# EAGLE design mapleCUx_large_102 (EAGLE 7.3.0)
MAPLE-CUx Large Version
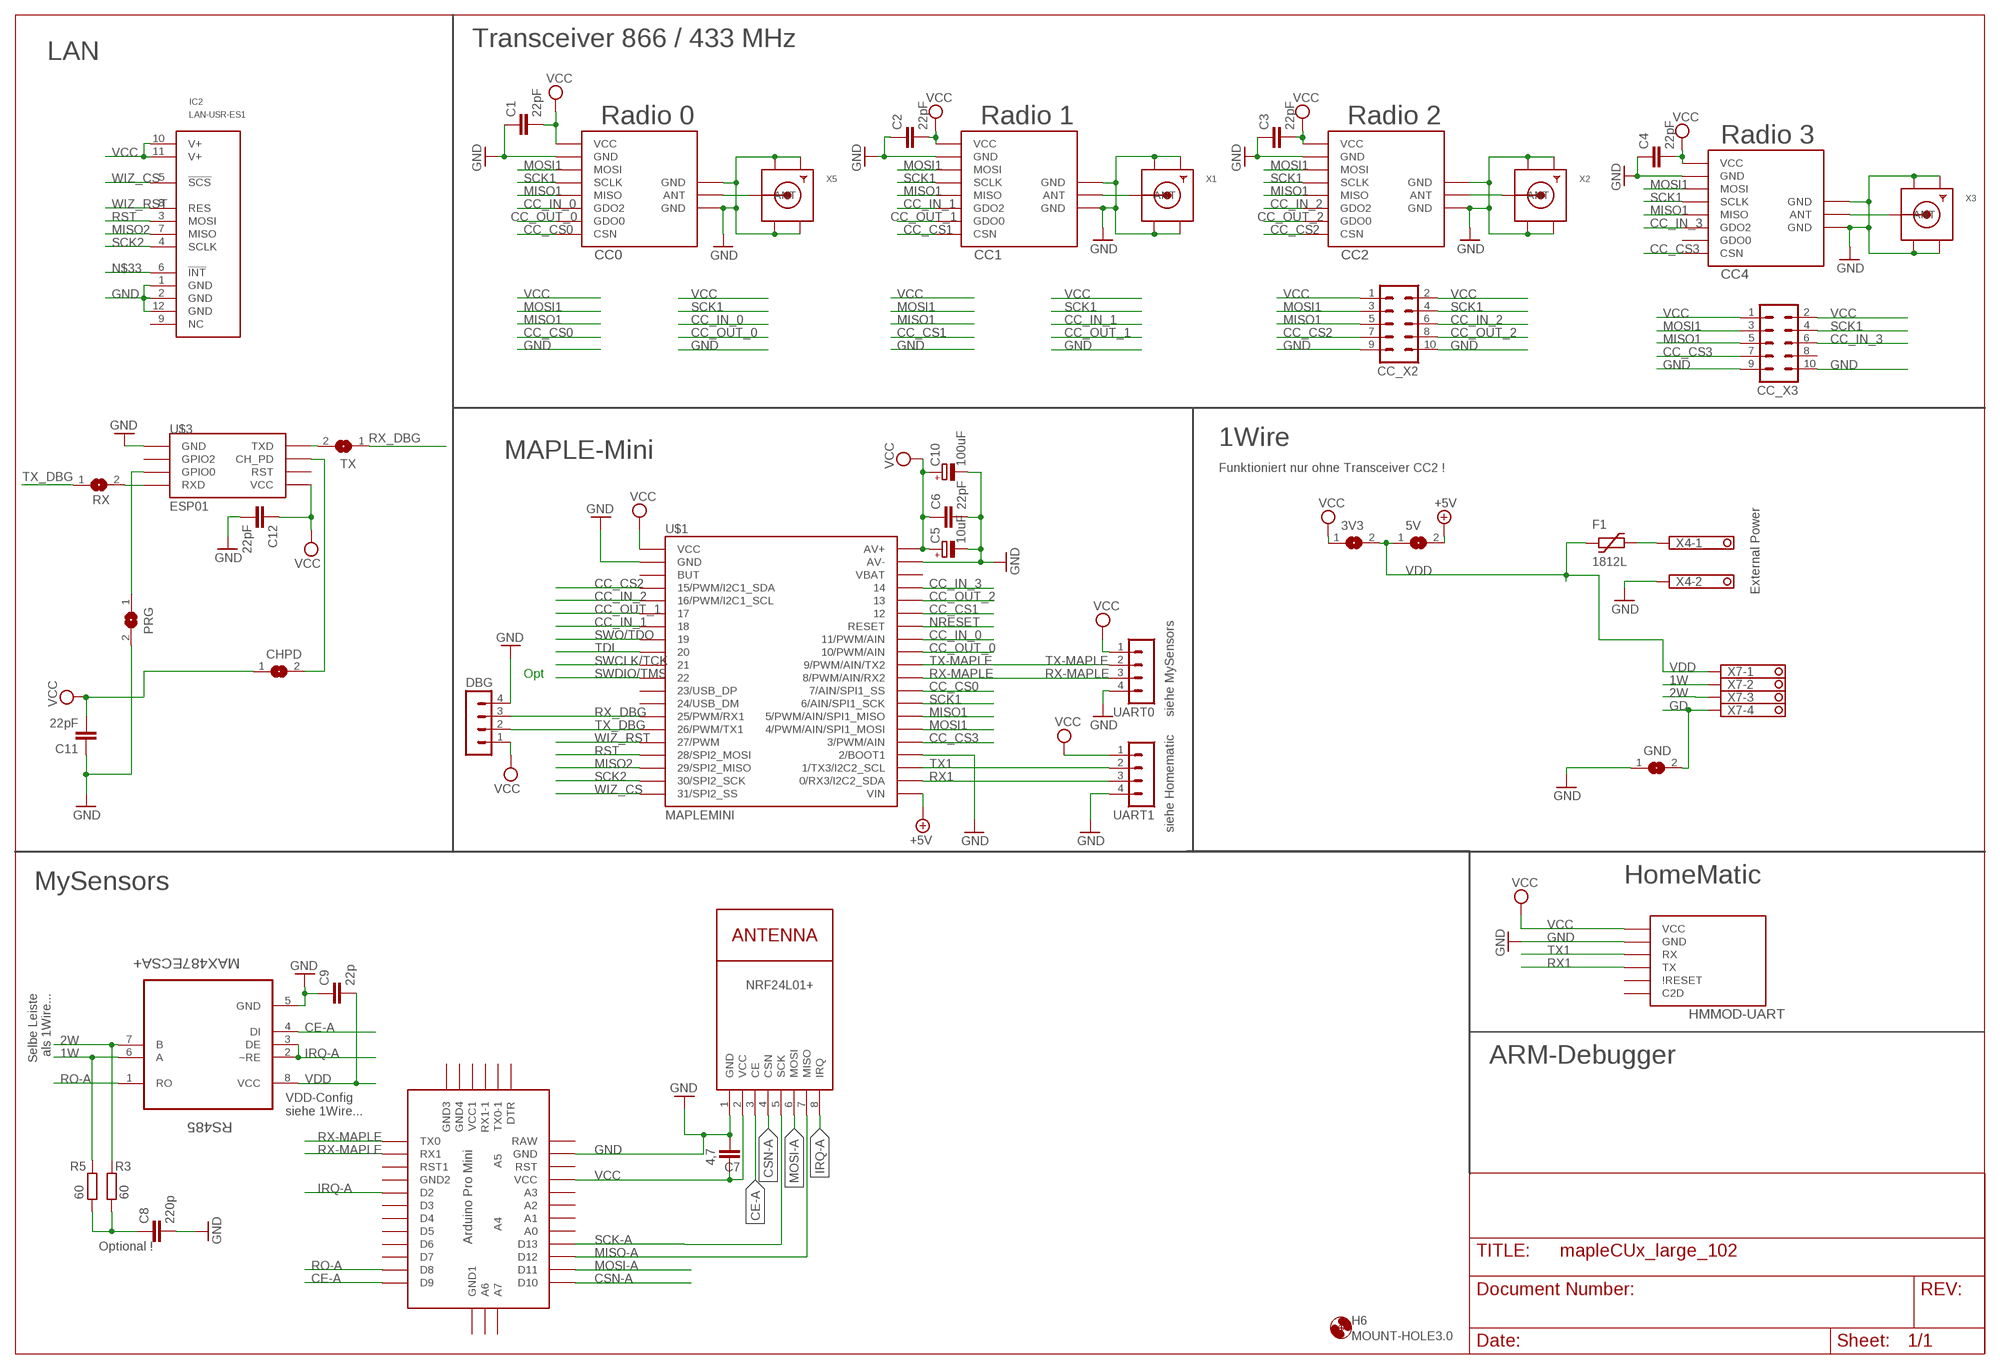
[diagram p0: schematic, sheet 1]

## Parts
3V3  SJ  [SJ]
5V  SJ  [SJ]
C1  22pF  C-EUC0805  [C0805]
C2  22pF  C-EUC0805  [C0805]
C3  22pF  C-EUC0805  [C0805]
C4  22pF  C-EUC0805  [C0805]
C5  10uF  CPOL-EUR/2012-12W  [R/2012-12W]
C6  22pF  C-EUC0805  [C0805]
C7  4,7  C-EUC1210  [C1210]
C8  220p  C-EUC0805  [C0805]
C9  22p  C-EUC0805  [C0805]
C10  100uF  CPOL-EUE5-8.5  [E5-8,5]
C11  22pF  C-EUC0805  [C0805]
C12  22pF  C-EUC0805  [C0805]
CC0  CC1101  CC1101_MODULE1SMD  [CC1101_MODULE1_SMD]
CC1  CC1101_MODULE1SMD  [CC1101_MODULE1_SMD]
CC2  CC1101_MODULE1SMD  [CC1101_MODULE1_SMD]
CC4  CC1101_MODULE1SMD  [CC1101_MODULE1_SMD]
CC_X2  MA05-2  [MA05-2]
CC_X3  MA05-2  [MA05-2]
CHPD  SJ  [SJ]
DBG  MA04-1  [MA04-1]
F1  1812L  [1812L]
GND  SJ  [SJ]
H6  MOUNT-HOLE3.0  [3,0]
HMMOD-UART  HM-MOD-UARTDIL  [HM-MOD-UART-DIL]
IC2  LAN-USR-ES1  [USR-ES1]
NRF24L01+  NRF24L01+  WIRELESS-NRF24L01  [WIRELESS-NRF24L01]
PRG  SJ  [SJ]
R3  60  R-EU_R0805  [R0805]
R5  60  R-EU_R0805  [R0805]
RS485  MAX487ECSA+  [SOIC127P600X175-8N]
RX  SJ  [SJ]
TX  SJ  [SJ]
U$1  MAPLEMINI  [20-DIP]
U$2  ABK-PRO-MINI  [ABK-PRO-MINI]
U$3  ESP01  [ESP01]
UART0  MA04-1  [MA04-1]
UART1  MA04-1  [MA04-1]
X1  SMACONNECTOR_EDGE_UFL  [SMA_EDGELAUNCH_UFL]
X2  SMACONNECTOR_EDGE_UFL  [SMA_EDGELAUNCH_UFL]
X3  SMACONNECTOR_EDGE_UFL  [SMA_EDGELAUNCH_UFL]
X4  1751248  [1751248]
X5  SMACONNECTOR_EDGE_UFL  [SMA_EDGELAUNCH_UFL]
X7  1751264  [1751264]

## Nets
1W: R5.2 RS485.6(A) X7.2
2W: R3.2 RS485.7(B) X7.3
+5V [PWR]: 5V.2 U$1.21(VIN)
CC_CS0: CC0.CSN U$1.29(7/AIN/SPI1_SS)
CC_CS1: CC1.CSN U$1.35
CC_CS2: CC2.CSN CC_X2.7 U$1.4(15/PWM/I2C1_SDA)
CC_CS3: CC4.CSN CC_X3.7 U$1.25(3/PWM/AIN)
CC_IN_0: CC0.GDO2 U$1.33(11/PWM/AIN)
CC_IN_1: CC1.GDO2 U$1.7
CC_IN_2: CC2.GDO2 CC_X2.6 U$1.5(16/PWM/I2C1_SCL)
CC_IN_3: CC4.GDO2 CC_X3.6 U$1.37
CC_OUT_0: CC0.GDO0 U$1.32(10/PWM/AIN)
CC_OUT_1: CC1.GDO0 U$1.6
CC_OUT_2: CC2.GDO0 CC_X2.8 U$1.36
CE-A: NRF24L01+.3(CE) RS485.4(DI) U$2.D9
CSN-A: NRF24L01+.4(CSN) U$2.D10
GD [PWR]: GND.2 X7.4
GND [PWR]: C1.1 C2.1 C3.1 C4.1 C5.- C6.2 C7.1 C8.2 C9.1 C10.- C11.1 C12.2 CC0.GND@0(GND) CC0.GND@1(GND) CC0.GND@2(GND) CC1.GND@0(GND) CC1.GND@1(GND) CC1.GND@2(GND) CC2.GND@0(GND) CC2.GND@1(GND) CC2.GND@2(GND) CC4.GND@0(GND) CC4.GND@1(GND) CC4.GND@2(GND) CC_X2.9 CC_X2.10 CC_X3.9 CC_X3.10 DBG.4 GND.1 HMMOD-UART.2(GND) IC2.1(GND) IC2.2(GND) IC2.12(GND) NRF24L01+.1(GND) PRG.2 RS485.5(GND) U$1.2(GND) U$1.24(2/BOOT1) U$1.39(AV-) U$2.GND U$3.GND UART0.4 UART1.4 X1.GND@1(GND1) X1.GND@2(GND2) X1.GND@3(GND3) X1.GND@4(GND4) X2.GND@1(GND1) X2.GND@2(GND2) X2.GND@3(GND3) X2.GND@4(GND4) X3.GND@1(GND1) X3.GND@2(GND2) X3.GND@3(GND3) X3.GND@4(GND4) X4.2 X5.GND@1(GND1) X5.GND@2(GND2) X5.GND@3(GND3) X5.GND@4(GND4)
IRQ-A: NRF24L01+.8(IRQ) RS485.2(~RE) RS485.3(DE) U$2.D2
MISO1: CC0.MISO CC1.MISO CC2.MISO CC4.MISO CC_X2.5 CC_X3.5 U$1.27(5/PWM/AIN/SPI1_MISO)
MISO2: IC2.7(MISO) U$1.18(29/SPI2_MISO)
MISO-A: NRF24L01+.7(MISO) U$2.D12
MOSI1: CC0.MOSI CC1.MOSI CC2.MOSI CC4.MOSI CC_X2.3 CC_X3.3 U$1.26(4/PWM/AIN/SPI1_MOSI)
MOSI-A: NRF24L01+.6(MOSI) U$2.D11
N$1: CC1.ANT X1.P(ANT)
N$2: CC4.ANT X3.P(ANT)
N$3: CC2.ANT X2.P(ANT)
N$4: CC0.ANT X5.P(ANT)
N$8: RX.2 U$3.RX(RXD)
N$10: TX.2 U$3.TX(TXD)
N$11: PRG.1 U$3.GPIO0
N$12: CHPD.2 U$3.CH_PD
N$21: C8.1 R3.1 R5.1
N$33: IC2.6(!INT!)
N$45 [PWR]: F1.P$2 X4.1
NRESET: U$1.34(RESET)
RO-A: RS485.1(RO) U$2.D8
RST: IC2.3(MOSI) U$1.17(28/SPI2_MOSI)
RX1: HMMOD-UART.5(TX) U$1.22(0/RX3/I2C2_SDA) UART1.3
RX-MAPLE: U$1.30(8/PWM/AIN/RX2) U$2.RX1 U$2.TX0 UART0.3
RX_DBG: DBG.3 TX.1 U$1.14(25/PWM/RX1)
SCK1: CC0.SCLK CC1.SCLK CC2.SCLK CC4.SCLK CC_X2.4 CC_X3.4 U$1.28(6/AIN/SPI1_SCK)
SCK2: IC2.4(SCLK) U$1.19(30/SPI2_SCK)
SCK-A: NRF24L01+.5(SCK) U$2.D13
SWCLK/TCK: U$1.10
SWDIO/TMS: U$1.11
SWO/TDO: U$1.8
TDI: U$1.9
TX1: HMMOD-UART.6(RX) U$1.23(1/TX3/I2C2_SCL) UART1.2
TX-MAPLE: U$1.31(9/PWM/AIN/TX2) UART0.2
TX_DBG: DBG.2 RX.1 U$1.15(26/PWM/TX1)
VCC [PWR]: 3V3.1 C1.2 C2.2 C3.2 C4.2 C5.+ C6.1 C7.2 C10.+ C11.2 C12.1 CC0.VCC CC1.VCC CC2.VCC CC4.VCC CC_X2.1 CC_X2.2 CC_X3.1 CC_X3.2 CHPD.1 DBG.1 HMMOD-UART.1(VCC) IC2.10(V+) IC2.11(V+) NRF24L01+.2(VCC) U$1.1(VCC) U$1.40(AV+) U$2.VCC U$3.VCC UART0.1 UART1.1
VDD [PWR]: 3V3.2 5V.1 C9.2 F1.P$1 RS485.8(VCC) X7.1
WIZ_CS: IC2.5(!SCS!) U$1.20(31/SPI2_SS)
WIZ_RST: IC2.8(RES) U$1.16(27/PWM)
Unconnected: CC4.GDO0 CC_X3.8 HMMOD-UART.3(C2D) HMMOD-UART.4(\!RESET) IC2.9(NC) U$1.3(BUT) U$1.12(23/USB_DP) U$1.13(24/USB_DM) U$1.38(VBAT) U$2.A0 U$2.A1 U$2.A2 U$2.A3 U$2.A4 U$2.A5 U$2.A6 U$2.A7 U$2.D3 U$2.D4 U$2.D5 U$2.D6 U$2.D7 U$2.DTR U$2.GND1(GND2) U$2.GND2(GND3) U$2.GND3(GND4) U$2.GND4(GND1) U$2.RAW U$2.RST U$2.RST1 U$2.RX1-1 U$2.TX0-1 U$2.VCC1 U$3.GPIO2 U$3.RST

## Notes on the sheet
- Transceiver 866 / 433 MHz
- LAN
- Radio 0 | Radio 1 | Radio 2
- Radio 3
- 1Wire
- MAPLE-Mini
- Funktioniert nur ohne Transceiver CC2 !
- External Power
- Opt
- siehe MySensors
- siehe Homematic
- MySensors | HomeMatic
- Selbe Leiste
  als 1Wire...
- ARM-Debugger
- VDD-Config
  siehe 1Wire...
- Optional !

## Library data of the parts
3V3 5V CHPD GND PRG RX TX = jumper:SJ: SMD solder JUMPER
C1-C4 C6-C9 C11 C12 = rcl:C-EU: CAPACITOR, European symbol
C5 C10 = rcl:CPOL-EU: POLARIZED CAPACITOR, European symbol
CC0 CC1 CC2 CC4 = wireless:CC1101_MODULE1: CC1101 wireless module for 433/868 MHz (sold from Aliexpress). DIL version for mounting with pin header (and SMD soldering) and SMD only variant available.
CC_X2 CC_X3 = con-lstb:MA05-2: PIN HEADER; OC_FARNELL: unknown; OC_NEWARK: unknown
DBG UART0 UART1 = con-lstb:MA04-1: PIN HEADER; OC_FARNELL: unknown; OC_NEWARK: unknown
F1 = ptc-littlefuse:1812L
H6 = holes:MOUNT-HOLE: MOUNTING HOLE with drill center marker
HMMOD-UART = wireless:HM-MOD-UART: eQ3 HM-MOD-UART-AW-SH2 wireless module for 868 MHz. DIL version for mounting with pin header (antenna upwards) and SMD variant available (antenna downwards).
IC2 = Martin-Communication:LAN-USR-ES1
NRF24L01+ = diy-modules:WIRELESS-NRF24L01: 2.4 GHz Wireless Module based on NRF24L01 chip
R3 R5 = rcl:R-EU_: RESISTOR, European symbol
RS485 = Maxim_By_element14_Batch_1:MAX487ECSA+: Low-Power, Slew-Rate-Limited RS-485/RS-422 Transceivers; MPN: MAX487ECSA+; OC_FARNELL: 9724532; OC_NEWARK: 68K4803; PACKAGE: SOIC-8; SUPPLIER: Maxim
U$1 = maplemini-small:MAPLEMINI
U$2 = Arduino-clone:ABK-PRO-MINI: ABK Pro-Mini Arduino Clone
U$3 = esp8266modules:ESP01: ESP8266 Wifi module 01
X1-X3 X5 = adafruit:SMACONNECTOR: SMA Connector 90° DIP SMA Connector, 50 Ohm (4UConnector: 07259)
X4 = con-phoenix-350:1751248: MKDS 1/ 2-3,5 Printklemme Nennstrom: 10 A Bemessungsspannung: 160 V Raster: 3,5 mm Polzahl: 2 Montageart: Löten Anschlussart: Schraubanschluss Anschlussrichtung vom Leiter zur Platine: 0° Source: http://eshop.phoenixcontact.com .. 1751248.pdf; OC_FARNELL: unknown; OC_NEWARK: unknown
X7 = con-phoenix-350:1751264: MKDS 1/ 4-3,5 Printklemme Nennstrom: 10 A Bemessungsspannung: 160 V Raster: 3,5 mm Polzahl: 4 Montageart: Löten Anschlussart: Schraubanschluss Anschlussrichtung vom Leiter zur Platine: 0° Source: http://eshop.phoenixcontact.com .. 1751264.pdf; MPN: 1751264; OC_FARNELL: unknown; OC_NEWARK: 10R0934

## Net classes
0 default: width 0.305 mm
1 PWR: width 0.457 mm

## Board
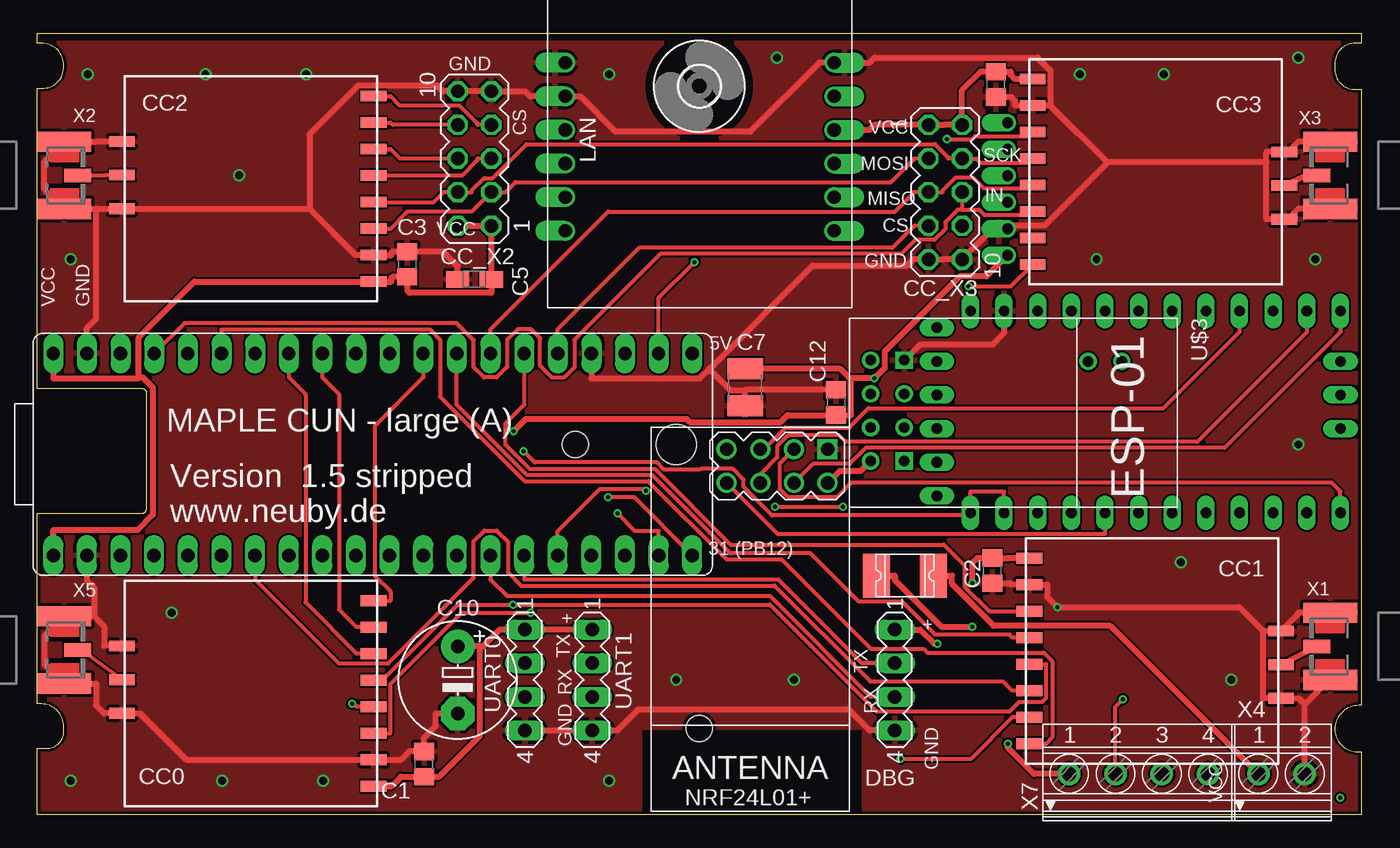
[diagram p1: board, top side]
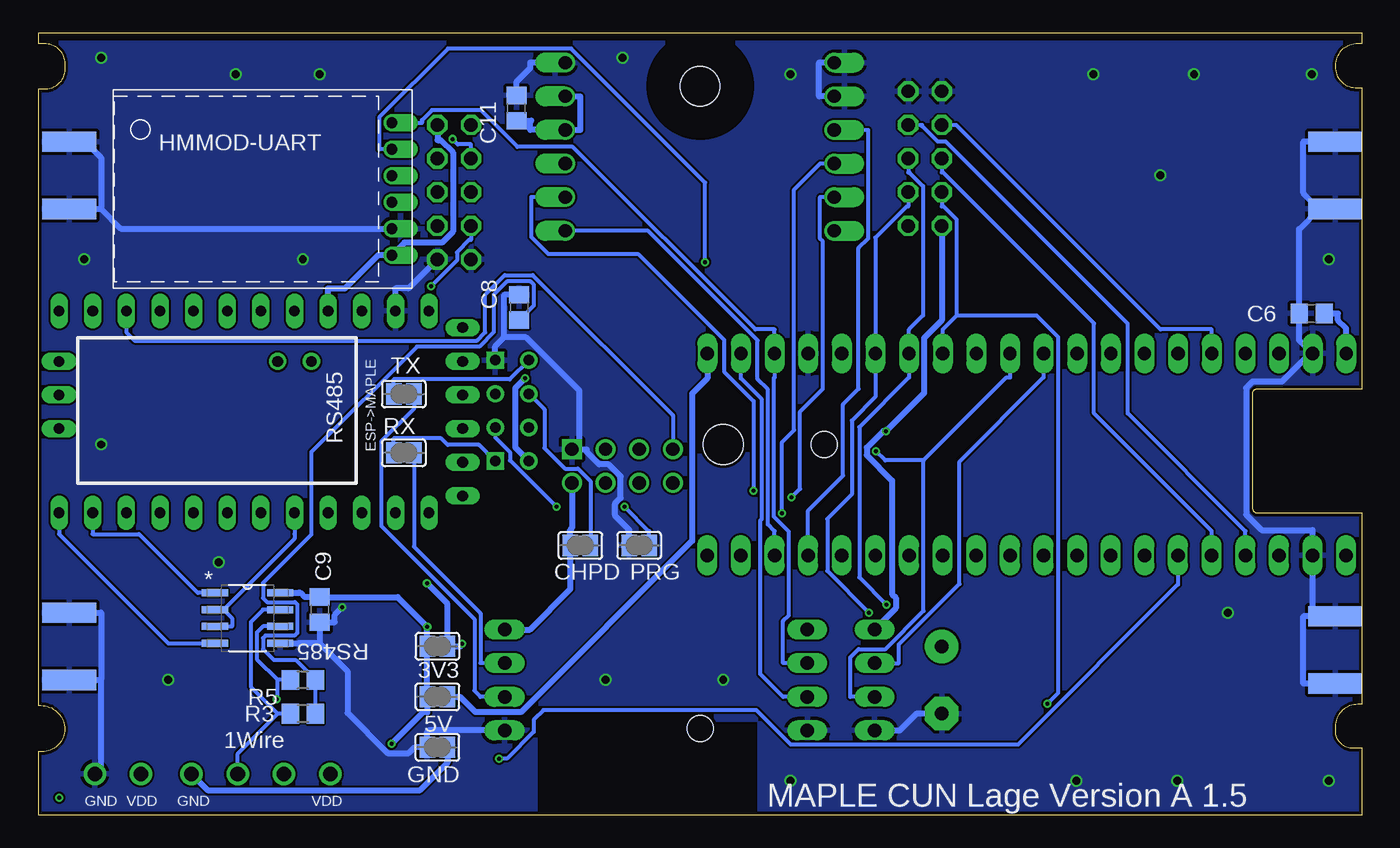
[diagram p2: board, bottom side, seen from below]

Size 100 x 59 mm. Coordinates in mm from the lower left corner, seen from the top.
Outline: 0,0 0,5 0.71,5 arc90 2,6.29 2,6.67 arc90 0.32,8.35 0,8.35 0,22.73 7.89,22.73 arc90 8.26,23.1 8.26,31.84 arc90 7.97,32.13 0,32.13 0,54.83 0.39,54.83 arc90 2,56.44 2,56.57 arc90 0.33,58.24 0,58.24 0,59 100,59 100,58.24 99.54,58.24 arc90 98,56.7 98,56.41 arc90 99.41,54.75 100,54.75 100,8.24 99.8,8.24 arc90 98,6.44 arc90 99.69,4.75 100,4.75 100,0 0,0
Copper layers (1*16): Top 0.035mm / dielectric 1.5mm / Bottom 0.035mm
Design rules "SeeedStudio_2layer_DRU_no_angle_20140221": minimum track width 6mil, minimum drill 12mil, track to track 6mil, track to pad 6mil, pad to pad 6mil, via to via 6mil, smd to smd 0mil, copper to edge 10mil, drill to drill 10mil, minimum pad ring 10mil, minimum via ring 6mil, stop-mask expansion 2mil, vias tented up to drill 100mil, thermal gap 10mil
Holes 2 mm at 50,6.5 40.64,27.94
Holes 3 mm at 48.26,27.94
tRestrict: area 0,58.6 to 100,59; area 45.7,0 to 62.2,6.3; area 0,22.9 to 8.1,32
bRestrict: area 0,58.6 to 100,59; area 0,58.6 to 100,59; area 45.7,0 to 62.2,7; area 0,22.9 to 8.1,32

### Footprints (pad centres in the part's own frame; a part is rotated, then mirrored left to right if it is on the bottom)
SJ = smd 1.168 x 1.6: 1 -0.762,0; 2 0.762,0
C0805 = smd 1.3 x 1.5: 1 -0.95,0; 2 0.95,0
R/2012-12W = smd 1.75 x 1.26: + 1.275,0; - -1.275,0
C1210 = smd 1.6 x 2.7: 1 -1.4,0; 2 1.4,0
E5-8,5 = drill 1.016 pad 2.54: + -2.54,0 | drill 1.016 pad 2.54 octagon: - 2.54,0
CC1101_MODULE1_SMD = smd 1.93 x 0.813: ANT 19,5.96; CSN 0,0; GDO0 0,2; GDO2 0,4; GND@0 0,12; GND@1 19,8.5; GND@2 19,3.42; MISO 0,6; MOSI 0,10; SCLK 0,8; VCC 0,14
MA05-2 = drill 1.016 octagon: 1 -5.08,-1.27; 2 -5.08,1.27; 3 -2.54,-1.27; 4 -2.54,1.27; 5 0,-1.27; 6 0,1.27; 7 2.54,-1.27; 8 2.54,1.27; 9 5.08,-1.27; 10 5.08,1.27
MA04-1 = drill 1.016 long: 1 -3.81,0; 2 -1.27,0; 3 1.27,0; 4 3.81,0
1812L = smd 2.03 x 3.3: P$1 -2.16,0; P$2 2.16,0
3,0 = hole 3: 0,0
HM-MOD-UART-DIL = drill 0.8 offset: 1 0,12; 2 0,10; 3 0,8; 4 0,6; 5 0,4; 6 0,2
USR-ES1 = drill 1 pad 1.35 offset: 1 -10.16,5.715; 2 -10.16,3.175; 3 -10.16,0.635; 4 -10.16,-1.905; 5 -10.16,-4.445; 6 -10.16,-6.985; 7 10.16,-6.985; 8 10.16,-4.445; 9 10.16,-1.905; 10 10.16,0.635; 11 10.16,3.175; 12 10.16,5.715
WIRELESS-NRF24L01 = drill 1 square: 1 -12.7,6.35 | drill 1: 2 -10.16,6.35; 3 -12.7,3.81; 4 -10.16,3.81; 5 -12.7,1.27; 6 -10.16,1.27; 7 -12.7,-1.27; 8 -10.16,-1.27
R0805 = smd 1.3 x 1.5: 1 -0.95,0; 2 0.95,0
SOIC127P600X175-8N = smd 1.981 x 0.533: 1 -2.464,1.905; 2 -2.464,0.635; 3 -2.464,-0.635; 4 -2.464,-1.905; 5 2.464,-1.905; 6 2.464,-0.635; 7 2.464,0.635; 8 2.464,1.905
20-DIP = drill 1.016 pad 1.27 long: 1 -24.13,-7.62; 2 -21.59,-7.62; 3 -19.05,-7.62; 4 -16.51,-7.62; 5 -13.97,-7.62; 6 -11.43,-7.62; 7 -8.89,-7.62; 8 -6.35,-7.62; 9 -3.81,-7.62; 10 -1.27,-7.62; 11 1.27,-7.62; 12 3.81,-7.62; 13 6.35,-7.62; 14 8.89,-7.62; 15 11.43,-7.62; 16 13.97,-7.62; 17 16.51,-7.62; 18 19.05,-7.62; 19 21.59,-7.62; 20 24.13,-7.62 | drill 1 pad 1.27 long: 21 24.13,7.62; 22 21.59,7.62; 23 19.05,7.62; 24 16.51,7.62; 25 13.97,7.62; 26 11.43,7.62; 27 8.89,7.62; 28 6.35,7.62; 29 3.81,7.62; 30 1.27,7.62; 31 -1.27,7.62; 32 -3.81,7.62; 33 -6.35,7.62; 34 -8.89,7.62; 35 -11.43,7.62; 36 -13.97,7.62; 37 -16.51,7.62; 38 -19.05,7.62; 39 -21.59,7.62; 40 -24.13,7.62
ABK-PRO-MINI = drill 0.8 long: A0 10.16,-3.81; A1 10.16,-6.35; A2 10.16,-8.89; A3 10.16,-11.43; A6 3.81,-21.59; A7 6.35,-21.59; D2 -5.08,-3.81; D3 -5.08,-6.35; D4 -5.08,-8.89; D5 -5.08,-11.43; D6 -5.08,-13.97; D7 -5.08,-16.51; D8 -5.08,-19.05; D9 -5.08,-21.59; D10 10.16,-21.59; D11 10.16,-19.05; D12 10.16,-16.51; D13 10.16,-13.97; DTR 8.89,8.89; GND 10.16,3.81; GND1 -5.08,-1.27; GND2 -3.81,8.89; GND3 -1.27,8.89; GND4 1.27,-21.59; RAW 10.16,6.35; RST 10.16,1.27; RST1 -5.08,1.27; RX1 -5.08,3.81; RX1-1 3.81,8.89; TX0 -5.08,6.35; TX0-1 6.35,8.89; VCC 10.16,-1.27; VCC1 1.27,8.89 | drill 0.8: A4 6.35,-5.08; A5 6.35,-2.54
ESP01 = drill 0.8: CH_PD -1.285,-8.178; GPIO0 1.255,-5.638; GPIO2 -1.285,-5.638; RST 1.255,-8.178; TX -3.825,-8.178; VCC 3.795,-8.178 | drill 0.8 square: GND -3.825,-5.638; RX 3.795,-5.638
SMA_EDGELAUNCH_UFL = smd 4.064 x 1.524: GND@1 2.032,-2.54; GND@2 2.032,2.54 | smd 4.064 x 1.524 bottom: GND@3 2.032,2.54; GND@4 2.032,-2.54 | smd 2.032 x 1.016: P 3.048,0
1751248 = drill 1.1 pad 1.7: 1 -1.75,-0.1; 2 1.75,-0.1
1751264 = drill 1.1 pad 1.7: 1 -5.25,-0.1; 2 -1.75,-0.1; 3 1.75,-0.1; 4 5.25,-0.1

### Placement (x,y rotation side)
3V3  69.85,12.7 180 bottom
5V  69.85,8.89 0 bottom
C1  29.21,3.81 270 top
C2  72.14,18.41 90 top
C3  27.94,41.55 270 top
C4  72.39,55.13 90 top
C5  33.02,40.4 0 top
C6  3.81,37.83 180 bottom
C7  53.47,32.26 90 top
C8  63.67,38.3 90 bottom
C9  78.74,15.47 90 bottom
C10  31.75,10.16 270 top
C11  63.88,53.34 270 bottom
C12  60.33,31.11 90 top
CC0  25.4,16.14 180 top
CC1  74.93,5.35 0 top
CC2  25.4,54.24 180 top
CC4  75.18,41.53 0 top
CC_X2  33.02,49.53 90 top
CC_X3  68.58,46.99 270 top
CHPD  59.05,20.32 0 bottom
DBG  64.77,10.16 270 top
F1  65.53,18.03 0 top
GND  69.85,5.08 0 bottom
H6  50,55 0 top
HMMOD-UART  73.28,54.23 180 bottom
IC2  50.04,51.05 0 top
NRF24L01+  53.34,14.88 270 top
PRG  54.61,20.32 180 bottom
R3  80.01,7.62 180 bottom
R5  80.01,10.16 180 bottom
RS485  84.19,14.84 0 bottom
RX  72.39,27.3 180 bottom
TX  72.39,31.75 180 bottom
U$1  25.34,27.19 0 top
U$2  76.83,27.87 90 top
U$3  71.12,30.48 270 top
UART0  36.83,10.16 270 top
UART1  41.91,10.16 270 top
X1  99.69,12.7 180 top
X2  0,48.26 0 top
X3  99.69,48.26 180 top
X4  93.98,3.17 0 top
X5  0,12.43 0 top
X7  83.19,3.17 0 top

### Tracks (layer width: path | path; a pad name or v marks a point on that pad's centre or on a via)
1W  (via drill 0.3 pad 0.61)
  Top 0.305: X7.2 81.44,8.15 v81.98,8.69
  Bottom 0.305: v81.98,8.69 81.92,8.76 81.92,10.16 | R5.2 81.92,10.16 | RS485.6 83.02,14.2 83.49,13.73 83.49,11.73 81.92,10.16
2W
  Bottom 0.305: X7.3 84.94,4.6 81.92,7.62 | R3.2 81.92,7.62 | RS485.7 83.02,15.47 83.95,14.54 83.95,9.66 81.92,7.62
+5V
  Bottom 0.457: 5V.2 68.12,8.89 66.97,7.74 63.54,7.74 50.61,20.67 50.61,31.78 49.47,32.92 U$1.21
CC_CS0
  Top 0.305: CC0.CSN 26.67,16.14 26.67,16.86 25.48,18.05 25.48,29.33 29.15,33 U$1.29
CC_CS1
  Top 0.305: CC1.CSN 76.2,5.35 76.67,5.82 76.67,11.57 76.02,12.22 67.25,12.22 66.96,12.51 62.97,12.51 56.22,19.26 52.06,19.26 46.14,25.18 36.79,25.18 30.42,31.55 30.42,35.86 29.65,36.63 13.91,36.63 U$1.35
CC_CS2
  Top 0.305: CC2.CSN 26.67,54.24 27.38,53.53 31.89,53.53 33.22,52.2 33.22,52.07 CC_X2.7
  Bottom 0.305: CC_X2.7 33.22,52.07 33.22,51.96 32.06,50.8 31.45,50.8 17.72,37.06 17.72,30.29 8.83,21.4 U$1.4
CC_CS3  (via drill 0.3 pad 0.61)
  Top 0.305: v70.34,39.87 73.53,39.87 CC4.CSN | CC_X3.7 66.24,44.45 64.58,42.78 45.46,42.78 39.31,36.63 U$1.25
  Bottom 0.305: CC_X3.7 67.31,43.38 67.44,43.38 68.38,42.45 68.38,41.84 v70.34,39.87
CC_IN_0
  Top 0.305: CC0.GDO2 24.13,12.14 20.26,16.02 20.26,31.73 18.99,33 U$1.33
CC_IN_1
  Top 0.305: CC1.GDO2 73.66,9.35 72.95,10.06 62.91,10.06 55.69,17.29 36.56,17.29 35.56,18.29 35.56,20.58 34.7,21.43 33.77,21.43 32.96,20.62 32.96,17.86 26.51,11.42 22.77,11.42 16.45,17.75 U$1.7
CC_IN_2
  Top 0.305: CC2.GDO2 26.67,50.24 27.39,49.53 CC_X2.6
  Bottom 0.305: CC_X2.6 31.75,48.46 31.64,48.46 20.26,37.08 20.26,30.29 11.37,21.4 U$1.5
CC_IN_3
  Top 0.305: 69.85,45.66 69.52,45.66 68.58,44.72 68.58,44.2 67.76,43.38 66.32,43.38 65.26,42.33 47.07,42.33 40.58,35.84 40.58,33.79 39.77,32.98 38.87,32.98 37.98,33.88 37.98,35.95 37.29,36.65 36.29,36.65 35.5,35.85 35.5,33.8 34.69,33 33.74,33 32.96,33.79 32.96,35.81 31.67,37.1 11.11,37.1 U$1.37 | CC_X3.6 69.85,45.66 | 69.85,45.66 71.14,45.66 71.54,45.27 74.92,45.27 CC4.GDO2
CC_OUT_0
  Top 0.305: CC0.GDO0 24.13,14.14 22.8,15.48 22.8,31.73 21.53,33 U$1.32
CC_OUT_1  (via drill 0.3 pad 0.61)
  Top 0.305: CC1.GDO0 73.66,7.35 70.53,4.22 v65.18,4.22
  Bottom 0.305: v65.18,4.22 64.6,4.22 62.58,6.25 62.58,7.15 61.85,7.87 45.75,7.87 43.16,5.28 26,5.28 13.91,17.38 13.91,17.75 U$1.6
CC_OUT_2
  Top 0.305: CC2.GDO0 26.67,52.24 26.84,52.07 CC_X2.8
  Bottom 0.305: CC_X2.8 30.68,52.07 15.24,36.63 11.37,36.63 U$1.36
CE-A
  Top 0.305: U$2.D9 98.42,24.4 97.78,25.05 61.47,25.05 60.39,23.97 56.69,23.97 56.09,24.57 56.09,26.51 NRF24L01+.3
  Bottom 0.305: U$2.D9 98.42,21.18 90.18,12.93 RS485.4
CSN-A
  Top 0.305: U$2.D10 98.42,36.42 89.69,27.68 62.57,27.68 61.35,26.47 58.58,26.47 NRF24L01+.4
GD
  Bottom 0.457: GND.2 69.09,3.9 71.14,1.84 87.2,1.84 X7.4
GND  (via drill 0.3 pad 0.61, 0.6)
  Top 0.457: UART0.4 UART1.4 43.81,6.35 45.4,7.93 61.28,7.93 62.87,6.35 DBG.4 | 92.84,49.28 92.84,50.03 CC4.GND@1 94.48,50.03 95.25,50.8 X3.GND@1 | 92.84,49.28 92.84,44.95 CC4.GND@2 94.48,44.95 95.25,45.72 X3.GND@2 | 80.78,49.28 92.84,49.28 | 80.78,49.28 76.53,53.53 | 80.78,49.28 80.78,49.16 76.1,44.48 73.53,44.48 HMMOD-UART.2 72.17,44.23 CC_X3.10 68.45,41.91 CC_X3.9 66.17,41.91 65.69,41.44 58.55,41.44 50.76,33.64 | 92.58,13.85 92.58,8.77 CC1.GND@2 95.28,8.77 95.73,8.32 | X4.2 95.73,8.32 | 92.58,13.85 90.78,15.65 v77.03,15.65 76.28,16.41 76.28,17.35 CC1.GND@0 73.58,17.35 73.47,17.46 C2.1 | 92.58,13.85 CC1.GND@1 95.25,15.17 95.25,15.24 X1.GND@1 | 20.55,45.74 24.05,42.24 CC2.GND@0 26.75,42.24 26.75,42.43 26.81,42.49 C3.1 30.66,42.49 31.75,41.41 C5.- | 20.55,45.74 CC2.GND@1 4.47,45.74 4.45,45.72 | 20.55,45.74 20.55,51.35 24.24,55.03 30.18,55.03 30.61,54.61 CC_X2.10 CC_X2.9 36.85,54.61 37.23,54.23 IC2.2 41.01,54.23 43.69,51.55 53.85,51.55 59.06,56.77 IC2.12 62.84,56.77 63.23,57.16 75.54,57.16 76.53,56.17 76.53,53.53 | X1.GND@2 97.57,10.16 95.73,8.32 | C4.1 73.52,54.18 73.84,53.87 73.84,53.53 CC4.GND@0 76.53,53.53 | C12.2 53.49,32.06 53.47,32.04 | 50.76,33.64 50.04,32.92 41.85,32.92 U$1.24 | 50.76,33.64 52.36,32.04 53.47,32.04 | C7.1 53.47,32.04 | CC2.GND@2 4.47,50.83 4.45,50.8 X2.GND@2 0.53,49.3 0.53,47.22 X2.GND@4 4.45,45.72 | U$1.39 3.75,36.7 4.45,37.4 4.45,45.72 | 4.29,14.97 4.29,17.12 3.75,17.67 U$1.2 | CC0.GND@2 5.05,12.72 5.05,14.21 4.29,14.97 | 4.29,14.97 X5.GND@2 0.53,13.47 0.53,11.39 X5.GND@1 4.45,9.89 4.45,8.25 5.05,7.64 CC0.GND@1 7.75,7.64 11.25,4.14 CC0.GND@0 27.46,4.14 28.08,4.76 C1.1 29.21,5.79 30.1,6.68 30.1,7.62 C10.-
  Top 0.457: U$2.GND 73.03,36.34 72.17,35.49 66.67,35.49 U$3.GND
  Bottom 0.457: 78.74,12.93 76.64,10.83 76.64,7.67 73.61,4.64 72.01,4.64 71.58,5.08 GND.1 70.61,6.26 70.52,6.35 DBG.4 | 78.74,12.93 78.74,14.01 C9.1 77.61,14.52 77.61,15.08 v77.03,15.65 | 78.74,12.93 80.35,12.93 RS485.5 | 95.25,45.72 93.76,44.23 HMMOD-UART.2 | 95.25,45.72 95.25,49.59 96.46,50.8 X3.GND@1 | 64.8,36.02 64.8,39.24 C8.2 | 64.8,36.02 65.48,35.34 U$3.GND | 59.12,27.57 59.12,32 63.14,36.02 64.8,36.02 | 59.12,27.57 58.55,27.57 58.55,27.36 57.63,26.44 56.92,26.44 56.02,25.54 56.02,23.92 56.42,23.52 56.42,22.55 55.37,21.5 PRG.2 | NRF24L01+.1 59.12,27.57 | C11.1 63.88,55.32 62.84,56.36 62.84,56.77 IC2.12 | IC2.1 41.01,56.77 41.01,54.23 IC2.2 | UART0.4 34.92,6.35 33.66,7.62 C10.- | 3.24,45.72 4.76,44.2 C6.2 4.76,35.83 3.84,34.9 | X2.GND@2 4.45,50.8 4.45,46.93 3.24,45.72 | X2.GND@4 3.24,45.72 | 3.25,14.97 3.75,15.47 U$1.2 3.75,21.48 7.6,21.48 8.76,22.64 8.76,32.22 8.3,32.68 6.06,32.68 3.84,34.9 | 3.25,14.97 4.45,14.97 4.45,9.89 X5.GND@1 | X5.GND@2 3.25,14.97 | X1.GND@1 95.25,15.24 95.25,10.16 | U$2.GND 73.03,39.72 72.04,39.72 CC_X3.10 | X3.GND@2 95.25,45.72 | X1.GND@2 95.25,10.16 | X4.2 95.25,3.56 95.25,10.16 | 3.84,34.9 U$1.39
  other vias: 3.81,55.88 12.7,55.88 20.32,55.88 43.18,55.88 55.88,57.15 78.74,55.88 95.25,57.15 85.09,55.88 96.52,41.91 95.25,27.94 90.17,10.16 57.15,10.16 43.18,2.54 21.59,2.54 13.97,2.54 2.54,2.54 10.16,15.24 2.54,41.91 15.24,48.26 80.01,41.91 48.26,10.16 86.36,19.05
  pour Bottom: -2.54,0 -2.54,60.96 101.6,60.96 101.6,58.42 101.6,0
  pour Top: -2.54,58.42 104.14,58.42 104.14,0 -2.54,0
IRQ-A
  Top 0.305: U$2.D2 80.64,21.18 55.93,21.18 NRF24L01+.8
  Bottom 0.305: 86,15.47 80.64,20.83 80.64,21.18 U$2.D2 | 86,15.47 85.35,14.82 85.35,14.2 RS485.3 | RS485.2 86,15.47
MISO1  (via drill 0.3 pad 0.61)
  Top 0.305: CC0.MISO 26.05,10.14 31.75,15.85 v35.93,15.85 55.34,15.85 63.39,7.79 73.45,7.79 74.17,8.51 75.9,8.51 76.2,8.81 76.2,11.35 CC1.MISO | CC_X2.5 33.22,49.53 33.22,49.4 32.07,48.24 CC2.MISO | U$1.27 34.23,36.63 43.12,45.52 64.77,45.52 66.24,46.99 CC_X3.5 68.38,46.99 68.38,47.1 69.35,48.07 70.72,48.07 71.53,47.26 74.91,47.26 CC4.MISO
  Bottom 0.305: v35.93,15.85 37.98,17.9 37.98,29.24 34.23,33 U$1.27 34.23,36.63 33.17,37.68 33.17,47.45 34.18,48.46 34.29,48.46 CC_X2.5
MISO2
  Bottom 0.305: IC2.7 53.93,44.07 45.66,35.8 45.66,32.88 44.89,32.11 44.89,21.91 44.39,21.4 U$1.18
MISO-A
  Bottom 0.305: U$2.D12 93.34,36.42 92.72,35.79 66.86,35.79 66.24,36.41 66.24,39.26 64.77,40.73 62.66,40.73 52.07,30.14 NRF24L01+.7
MOSI1  (via drill 0.3 pad 0.61)
  Top 0.305: v37.25,15.24 32.04,15.24 26.67,9.86 26.67,6.14 CC0.MOSI | U$1.26 36.77,30.92 35.34,29.5 35.34,27.94 37.19,26.09 46.64,26.09 52.36,20.38 68.47,20.38 70.03,18.81 70.03,17.21 71.9,15.35 CC1.MOSI | CC_X3.3 66.24,49.53 64.46,47.74 36.11,47.74 35.36,46.99 CC_X2.3 32.83,45.53 27.96,45.53 26.67,44.24 CC2.MOSI | v68.72,51 70.61,51 70.84,51.23 74.88,51.23 CC4.MOSI
  Bottom 0.305: v37.25,15.24 40.4,18.39 40.4,22.32 38.56,24.17 38.56,29.74 36.77,31.53 U$1.26 36.77,43.56 34.4,45.92 34.29,45.92 CC_X2.3 | CC_X3.3 67.31,50.6 68.31,50.6 v68.72,51
MOSI-A
  Top 0.305: U$2.D11 95.89,36.42 87.61,28.14 61.06,28.14 60.57,28.64 56.71,28.64 55.88,27.8 55.88,26.97 54.61,25.7 NRF24L01+.6
N$1
  Top 0.457: CC1.ANT X1.P
N$2
  Top 0.457: CC4.ANT 95.89,48.26 X3.P
N$3
  Top 0.305: CC2.ANT 5.13,48.28 5.11,48.26 X2.P
N$4
  Top 0.305: CC0.ANT 3.81,12.06 X5.P
N$8
  Bottom 0.305: RX.2 73.15,28.41 69.56,28.41 69.06,27.92 66.72,27.92 U$3.RX
N$10
  Bottom 0.305: TX.2 73.15,32.85 64.39,32.85 U$3.TX
N$11  (via drill 0.3 pad 0.61)
  Top 0.305: v55.73,23.23 v60.86,23.23
  Bottom 0.305: U$3.GPIO0 65.48,28.47 64.37,27.36 64.37,26.75 v60.86,23.23 | PRG.1 53.85,21.43 53.92,21.43 v55.73,23.23
N$12
  Bottom 0.305: U$3.CH_PD 61.77,30.59 61.77,27.67 60.22,26.12 59.24,26.12 58.29,25.17 CHPD.2
N$21
  Bottom 0.305: R3.1 R5.1 80.57,11.67 82.22,11.67 83.02,12.47 83.02,13.32 82.84,13.5 80.64,13.5 80.43,13.72 80.43,15.86 80.6,16.04 82.72,16.04 83.02,16.34 83.02,17.48 79.38,21.12 79.38,27.36 71.4,35.33 66.67,35.33 65.59,36.41 65.59,39.25 64.58,40.25 62.83,40.25 62.56,39.98 62.56,38.45 C8.1
N$35  (via drill 0.3 pad 0.61)
  other vias: 98.42,1.27
N$45
  Top 0.457: F1.P$2 69.09,18.03 69.09,17.41 72.25,14.25 81.06,14.25 X4.1
RO-A
  Bottom 0.305: RS485.1 87.94,16.74 92.38,21.18 95.89,21.18 U$2.D8
RST
  Bottom 0.305: IC2.3 37.31,51.69 37.31,43.51 38.04,42.78 38.04,32.14 39.2,30.97 39.2,25.59 41.85,22.94 U$1.17
RX1  (via drill 0.3 pad 0.61)
  Top 0.305: U$1.22 46.93,39.01 v49.63,41.72
  Bottom 0.305: UART1.3 43.74,8.89 45.46,10.61 45.46,22.2 45.35,22.31 45.35,31.35 46.93,32.93 U$1.22 | HMMOD-UART.5 74.24,50.23 74.24,52.64 69.05,57.83 59.75,57.83 49.63,47.72 v49.63,41.72
RX-MAPLE  (via drill 0.3 pad 0.61)
  Top 0.305: v36.72,27.43 37.56,26.58 46.8,26.58 47.35,26.04 50.05,26.04 50.11,26.09 52.53,26.09 53.34,25.29 53.34,24.74 55.5,22.58 70.28,22.58 U$2.TX0 70.48,24.4 73.03,24.4 U$2.RX1
  Bottom 0.305: 33.12,26.73 36.03,26.73 v36.72,27.43 | 33.12,26.73 26.86,33 26.61,33 U$1.30 | 33.12,26.73 33.12,15.38 36.01,12.5 38.04,12.5 38.66,11.88 38.66,8.89 UART0.3
RX_DBG
  Top 0.305: DBG.3 62.94,8.89 55.33,16.5 35.47,16.5 34.23,17.75 U$1.14
  Bottom 0.305: TX.1 71.63,30.64 74.1,28.18 74.1,21.79 67.06,14.75 67.06,9.35 66.6,8.89 DBG.3
SCK1  (via drill 0.3 pad 0.61)
  Top 0.305: CC0.SCLK 24.13,8.14 23.91,8.37 v23.78,8.37 | CC4.SCLK 74.88,49.23 71.22,49.23 70.92,49.53 CC_X3.4 69.32,49.53 68.78,49.53 68.78,49.64 67.81,50.61 36.94,50.61 34.39,48.06 33.75,48.06 32.82,47.12 32.82,46.99 CC_X2.4 30.68,46.99 29.94,46.24 CC2.SCLK | U$1.28 31.69,30.95 37,25.64 46.45,25.64 52.37,19.72 58.41,19.72 62.05,16.08 65.34,16.08 67.83,13.58 73.43,13.58 73.66,13.35 CC1.SCLK
  Bottom 0.305: 30.63,37.68 30.63,44.91 31.64,45.92 31.75,45.92 CC_X2.4 | 30.63,37.68 31.69,36.63 U$1.28 | 30.63,37.68 24.61,37.68 22.98,36.06 22.98,9.16 v23.78,8.37
SCK2  (via drill 0.3 pad 0.61)
  Top 0.305: U$1.19 46.93,21.4 45.16,21.4 v43.82,22.74
  Bottom 0.305: IC2.4 40.94,49.15 42.91,47.17 42.91,29.02 43.82,28.11 v43.82,22.74
SCK-A
  Top 0.305: U$2.D13 90.81,36.42 85.06,30.68 62.78,30.68 61.31,29.21 56.52,29.21 54.88,27.57 NRF24L01+.5
TX1
  Bottom 0.305: HMMOD-UART.6 71.01,52.23 71.01,52.43 70.25,53.19 66.57,53.19 63.8,50.42 59.63,50.42 45.84,36.63 44.39,36.63 U$1.23 44.39,33 44.43,32.96 44.43,22.49 43.31,21.37 43.31,15.04 43.74,14.62 43.74,11.43 UART1.2
TX-MAPLE
  Bottom 0.305: U$1.31 24.07,33 30.42,26.65 30.42,17.42 35,12.84 35,11.43 UART0.2
TX_DBG
  Top 0.305: U$1.15 36.77,17.75 55.96,17.75 62.28,11.43 DBG.2
  Bottom 0.305: RX.1 71.63,20.23 66.6,15.2 66.6,11.43 DBG.2
VCC  (via drill 0.3 pad 0.61)
  Top 0.457: 7.66,33 7.97,33 8.72,32.25 8.72,22.62 7.58,21.48 1.21,21.48 U$1.1 | 7.66,33 7.58,32.92 1.21,32.92 U$1.40 | 7.66,33 7.66,36.04 11.86,40.24 CC2.VCC 25.51,40.24 26.75,40.24 26.75,40.53 26.81,40.59 C3.2 27.94,39.56 28.11,39.39 34.3,39.39 C5.+ 34.3,41.41 34.29,41.42 CC_X2.1 CC_X2.2 | 61.46,32.87 61.52,32.93 v63.24,32.93 64,33.69 64,34.94 69.7,40.64 71.69,40.64 HMMOD-UART.1 | 61.46,32.87 60.67,33.66 C7.2 | 61.46,32.87 61.46,30.16 C12.1 56.67,30.16 56.12,29.62 49.31,29.62 49.05,29.88 36.9,29.88 v35.97,28.94 | 33.41,12.7 C10.+ | 33.41,12.7 33.66,12.7 34.92,13.97 UART0.1 UART1.1 | 33.41,12.7 33.41,5.93 30.34,2.86 C1.2 27.46,2.86 26.75,2.15 CC0.VCC | DBG.1 66.67,13.97 67.75,12.89 v67.97,12.89 | CC4.VCC 73.84,55.53 73.52,55.85 73.52,56.08 C4.2 71.26,56.08 69.85,54.67 CC_X3.2 68.45,52.07 CC_X3.1 63.22,52.07 62.84,51.69 IC2.10 | CC1.VCC 73.28,19.35 73.27,19.36 C2.2 71,19.36 70.64,19 v70.64,17.47 | U$3.VCC 62.19,25.93 60.59,25.93 NRF24L01+.2
  Bottom 0.457: C6.1 1.83,37.83 1.83,37.33 1.21,36.7 U$1.40 | UART0.1 35.22,15.58 35.22,16.36 35.51,16.64 35.51,25.22 37.42,27.13 37.42,27.7 36.18,28.94 v35.97,28.94 33.09,31.82 33.09,35.98 31.75,37.32 CC_X2.2 | v67.97,12.89 68.12,12.74 68.12,12.7 3V3.1 69.09,15.91 v70.64,17.47 | NRF24L01+.2 59.69,21.63 59.82,21.5 CHPD.1 59.82,17.02 62.87,13.97 DBG.1 | v63.24,32.93 63.98,32.19 63.98,27.73 U$3.VCC | U$2.VCC 78.11,39.72 76.83,39.72 74.31,42.23 HMMOD-UART.1 72.33,43.18 69.5,43.18 68.67,44 68.67,49.99 69.61,50.93 69.85,50.93 CC_X3.2 | C11.2 62.75,52.39 62.84,52.3 62.84,51.69 IC2.10 59.06,51.69 59.06,54.23 IC2.11
VDD  (via drill 0.3 pad 0.61)
  Top 0.457: X7.1 75.29,3.08 73.31,5.05 v73.31,5.34 | F1.P$1 64.77,18.03 64.77,17.71 68.29,14.19 v70.61,14.19
  Bottom 0.457: v73.31,5.34 70.94,7.71 70.61,7.71 5V.1 3V3.2 v70.61,14.19 72.84,16.42 C9.2 79.87,16.42 80.19,16.74 80.35,16.74 RS485.8
WIZ_CS  (via drill 0.3 pad 0.61)
  Top 0.305: U$1.20 45.1,23.94 v43.09,23.94
  Bottom 0.305: IC2.5 40.94,46.61 40.94,43.48 40.74,43.28 40.74,32.14 42.45,30.43 42.45,24.59 v43.09,23.94
WIZ_RST  (via drill 0.3 pad 0.61)
  Top 0.305: v45.96,24.44 45.85,24.55 42.46,24.55 39.31,21.4 U$1.16
  Bottom 0.305: v45.96,24.44 45.96,31.21 48.2,33.44 48.2,35.83 54.7,42.34 61.49,42.34 62.77,43.62 62.77,46.61 IC2.8 | v45.96,24.44

### Text on the board
tNames: GND | CS | CC3 | VCC | MOSI | SCK | LAN | MISO | IN | VCC | CS | GND | VCC | GND | 5V | MAPLE CUN - large (A) | Version 1.5 stripped / www.neuby.de | 31 (PB12) | + | + | TX | TX | RX | GND | RX | GND | VCC
bNames: ESP->MAPLE | RS485 | 1Wire | MAPLE CUN Lage Version A 1.5 | VDD | GND | VDD | GND